# EAGLE design wd-adapter (EAGLE 6.5.0)
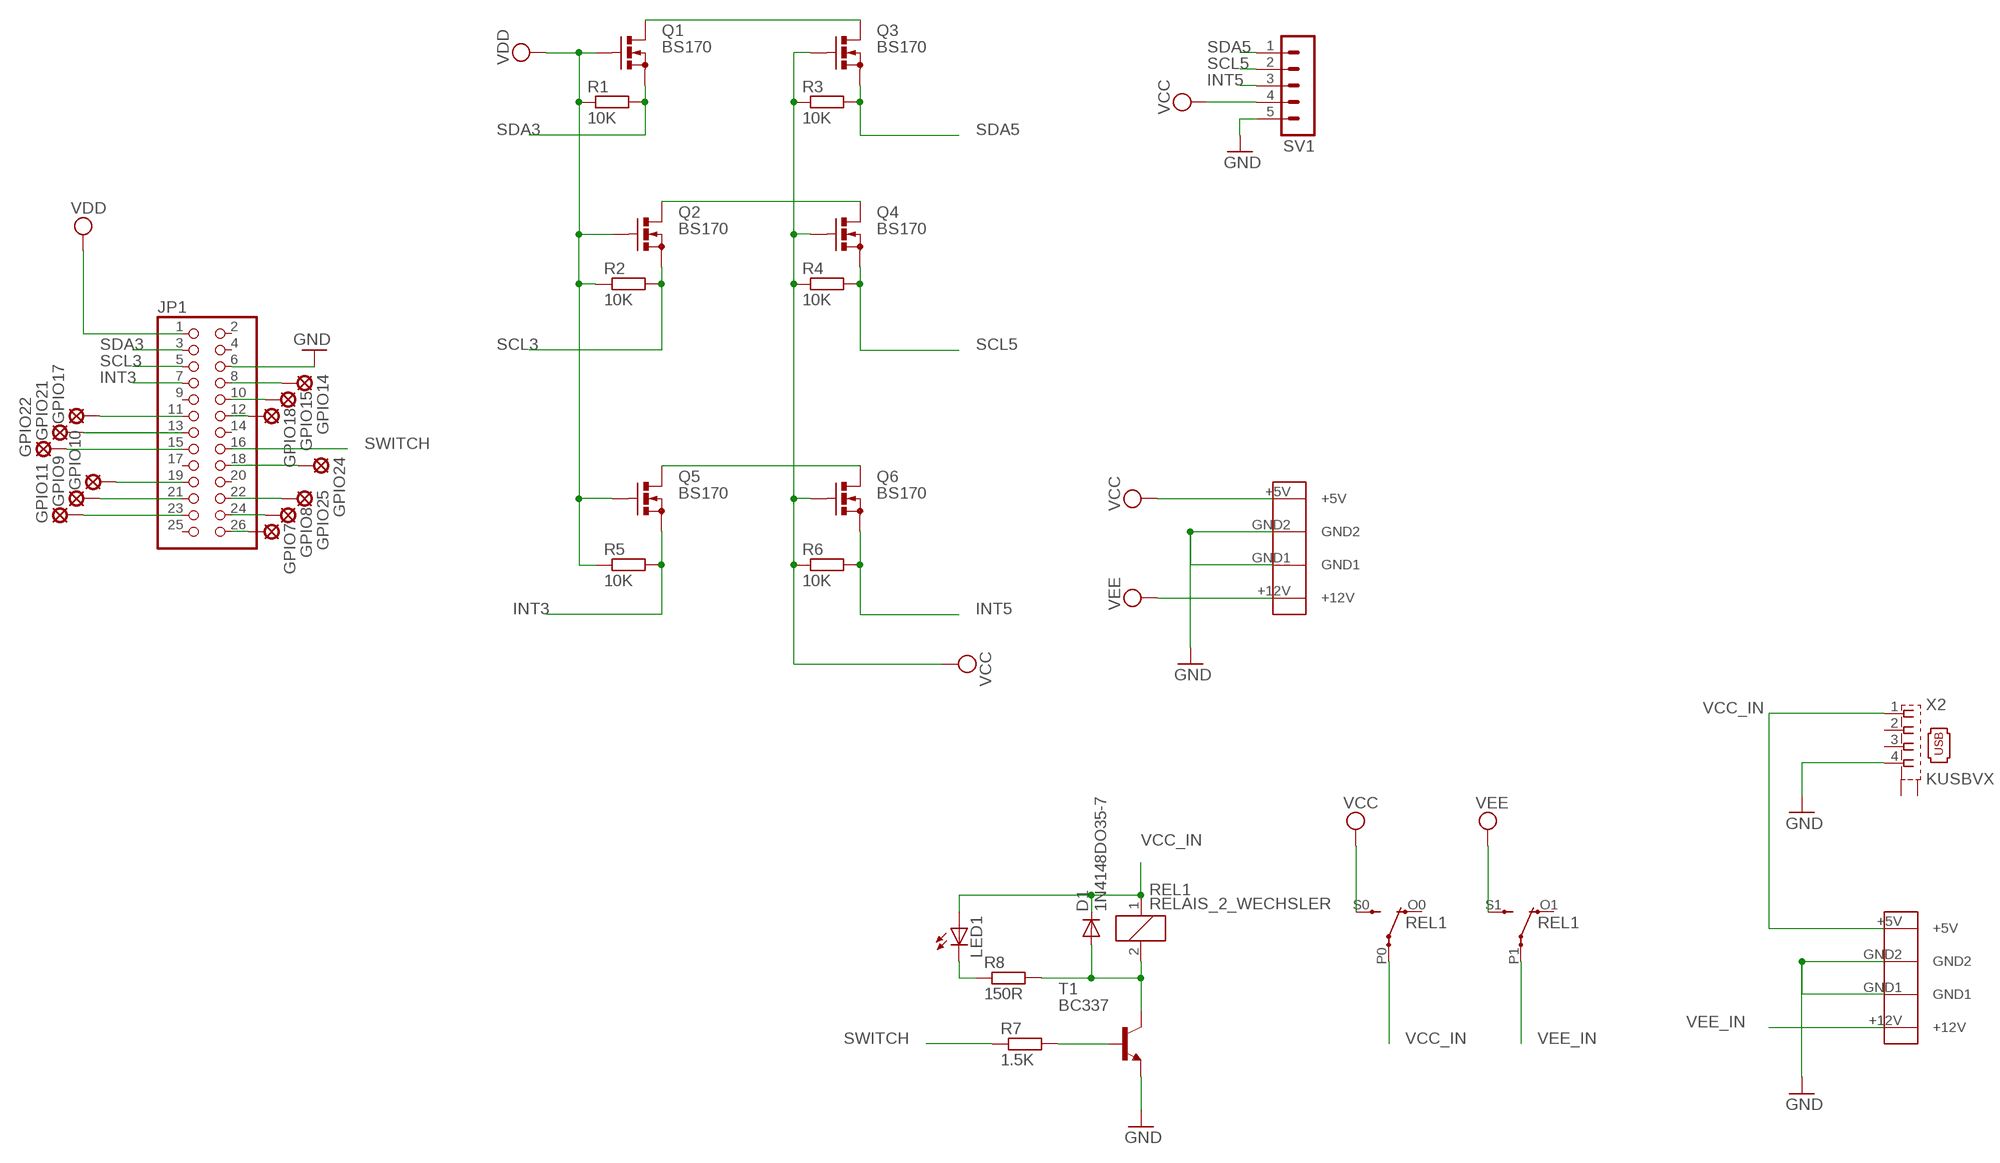
[diagram p0: schematic, sheet 1]

## Parts
D1  1N4148DO35-7  [DO35-7]
GPIO7  LSP10  [LSP10]
GPIO8  LSP10  [LSP10]
GPIO9  LSP10  [LSP10]
GPIO10  LSP10  [LSP10]
GPIO11  LSP10  [LSP10]
GPIO14  LSP10  [LSP10]
GPIO15  LSP10  [LSP10]
GPIO17  GPIO17  LSP10  [LSP10]
GPIO18  LSP10  [LSP10]
GPIO21  LSP10  [LSP10]
GPIO22  LSP10  [LSP10]
GPIO24  LSP10  [LSP10]
GPIO25  LSP10  [LSP10]
JP1  PINHD-2X13  [2X13]
LED1  LED3MM  [LED3MM]
Q1  BS170  [SOT54E]
Q2  BS170  [SOT54E]
Q3  BS170  [SOT54E]
Q4  BS170  [SOT54E]
Q5  BS170  [SOT54E]
Q6  BS170  [SOT54E]
R1  10K  R-EU_0207/2V  [0207/2V]
R2  10K  R-EU_0207/2V  [0207/2V]
R3  10K  R-EU_0207/2V  [0207/2V]
R4  10K  R-EU_0207/2V  [0207/2V]
R5  10K  R-EU_0207/2V  [0207/2V]
R6  10K  R-EU_0207/2V  [0207/2V]
R7  1.5K  R-EU_0207/7  [0207/7]
R8  150R  R-EU_0207/2V  [0207/2V]
REL1  RELAIS_2_WECHSLER  [RELAIS_DIL_M4]
SV1  MA05-1  [MA05-1]
T1  BC337  [TO92]
U$1  PSW_5  [PSW_5]
U$3  PSW_5  [PSW_5]
X2  KUSBVX  [KUSBVX]

## Nets
GND: JP1.6 SV1.5 T1.1(E) U$1.GND1 U$1.GND2 U$3.GND1 U$3.GND2 X2.4
INT3: JP1.7 Q5.S R5.2
INT5: Q6.S R6.2 SV1.3
N$1: GPIO17.MP JP1.11
N$2: GPIO21.MP JP1.13
N$3: GPIO22.MP JP1.15
N$4: GPIO10.MP JP1.19
N$5: GPIO9.MP JP1.21
N$6: GPIO11.MP JP1.23
N$7: GPIO14.MP JP1.8
N$8: GPIO15.MP JP1.10
N$9: GPIO18.MP JP1.12
N$10: LED1.K(C) R8.1
N$11: GPIO24.MP JP1.18
N$12: GPIO25.MP JP1.22
N$13: GPIO8.MP JP1.24
N$14: GPIO7.MP JP1.26
N$15: Q1.D Q3.D
N$16: Q2.D Q4.D
N$17: Q5.D Q6.D
N$18: D1.A R8.2 REL1.2 T1.3(C)
N$20: R7.2 T1.2(B)
SCL3: JP1.5 Q2.S R2.2
SCL5: Q4.S R4.2 SV1.2
SDA3: JP1.3 Q1.S R1.2
SDA5: Q3.S R3.2 SV1.1
SWITCH: JP1.16 R7.1
VCC: Q3.G Q4.G Q6.G R3.1 R4.1 R6.1 REL1.S0(W1:S) SV1.4 U$1.+5V
VCC_IN: D1.C LED1.A REL1.1 REL1.P0(W1:P) U$3.+5V X2.1
VDD: JP1.1 Q1.G Q2.G Q5.G R1.1 R2.1 R5.1
VEE: REL1.S1(W2:S) U$1.+12V
VEE_IN: REL1.P1(W2:P) U$3.+12V
Unconnected: JP1.2 JP1.4 JP1.9 JP1.14 JP1.17 JP1.20 JP1.25 REL1.O0(W1:O) REL1.O1(W2:O) X2.2 X2.3 X2.M1(S1) X2.M2(S2)

## Library data of the parts
D1 = diode:1N4148: DIODE high speed (Philips)
GPIO7-GPIO11 GPIO14 GPIO15 GPIO17 GPIO18 GPIO21 GPIO22 GPIO24 GPIO25 = solpad:LSP10: SOLDER PAD drill 1.0 mm, distributor Buerklin, 12H555
JP1 = pinhead:PINHD-2X13: PIN HEADER
LED1 = led:LED: LED OSRAM: - CHIPLED LG R971, LG N971, LY N971, LG Q971, LY Q971, LO R971, LY R971 LH N974, LH R974 LS Q976, LO Q976, LY Q976 LO Q996 - Hyper CHIPLED LW Q18S LB Q993, LB Q99A, LB R99A - SideLED LS A670, LO A670, LY A670, LG A670, LP A670 LB A673, LV A673, LT A673, LW A673 LH A674 LY A675 LS A676, LA A676, LO A676, LY A676, LW A676 LS A679, LY A679, LG A679 - Hyper Micro SIDELED® LS Y876, LA Y876, LO Y876, LY Y876 LT Y87S - SmartLED LW L88C, LW L88S LB L89C, LB L89S, LG L890 LS L89K, LO L89K, LY L89K LS L896, LA L896, LO L896, LY L896 - TOPLED LS T670, LO T670, LY T670, LG T670, LP T670 LSG T670, LSP T670, LSY T670, LOP T670, LYG T670 LG T671, LOG T671, LSG T671 LB T673, LV T673, LT T673, LW T673 LH T674 LS T676, LA T676, LO T676, LY T676, LB T676, LH T676, LSB T676, LW T676 LB T67C, LV T67C, LT T67C, LS T67K, LO T67K, LY T67K, LW E67C LS E67B, LA E67B, LO E67B, LY E67B, LB E67C, LV E67C, LT E67C LW T67C LS T679, LY T679, LG T679 LS T770, LO T770, LY T770, LG T770, LP T770 LB T773, LV T773, LT T773, LW T773 LH T774 LS E675, LA E675, LY E675, LS T675 LS T776, LA T776, LO T776, LY T776, LB T776 LHGB T686 LT T68C, LB T68C - Hyper Mini TOPLED® LB M676 - Mini TOPLED Santana® LG M470 LS M47K, LO M47K, LY M47K Source: http://www.osram.convergy.de LUXEON: - LUMILED® LXK2-PW12-R00, LXK2-PW12-S00, LXK2-PW14-U00, LXK2-PW14-V00 LXK2-PM12-R00, LXK2-PM12-S00, LXK2-PM14-U00 LXK2-PE12-Q00, LXK2-PE12-R00, LXK2-PE12-S00, LXK2-PE14-T00, LXK2-PE14-U00 LXK2-PB12-K00, LXK2-PB12-L00, LXK2-PB12-M00, LXK2-PB14-N00, LXK2-PB14-P00, LXK2-PB14-Q00 LXK2-PR12-L00, LXK2-PR12-M00, LXK2-PR14-Q00, LXK2-PR14-R00 LXK2-PD12-Q00, LXK2-PD12-R00, LXK2-PD12-S00 LXK2-PH12-R00, LXK2-PH12-S00 LXK2-PL12-P00, LXK2-PL12-Q00, LXK2-PL12-R00 Source: www.luxeon.com KINGBRIGHT: KA-3528ASYC Source: www.kingbright.com
Q1-Q6 = transistor-small-signal:BS170: N-CHANNEL MOS FET
R1-R8 = resistor:R-EU_: RESISTOR, European symbol
REL1 = n39:RELAIS_2_WECHSLER: 2-fach Wechsel-Relais Packages: M4 5V Spulenspannung (Reichelt M4 05H) Autor: Tux
SV1 = con-lstb:MA05-1: PIN HEADER; OC_FARNELL: unknown; OC_NEWARK: unknown
T1 = transistor:BC337: NPN TRANSISTOR
U$1 U$3 = n39:PSW_5: PSW 5 Stromversorgungsstecker f. 5 1/4 Zoll, Print, gew. http://www.reichelt.de/?ARTICLE=14915
X2 = con-kycon:KUSBVX: Vertical,Top Entry Universal Serial Bus Connector KUSBVX Series Source: KYCON Sibalco USB vertical socket KUSBV.pdf

## Board
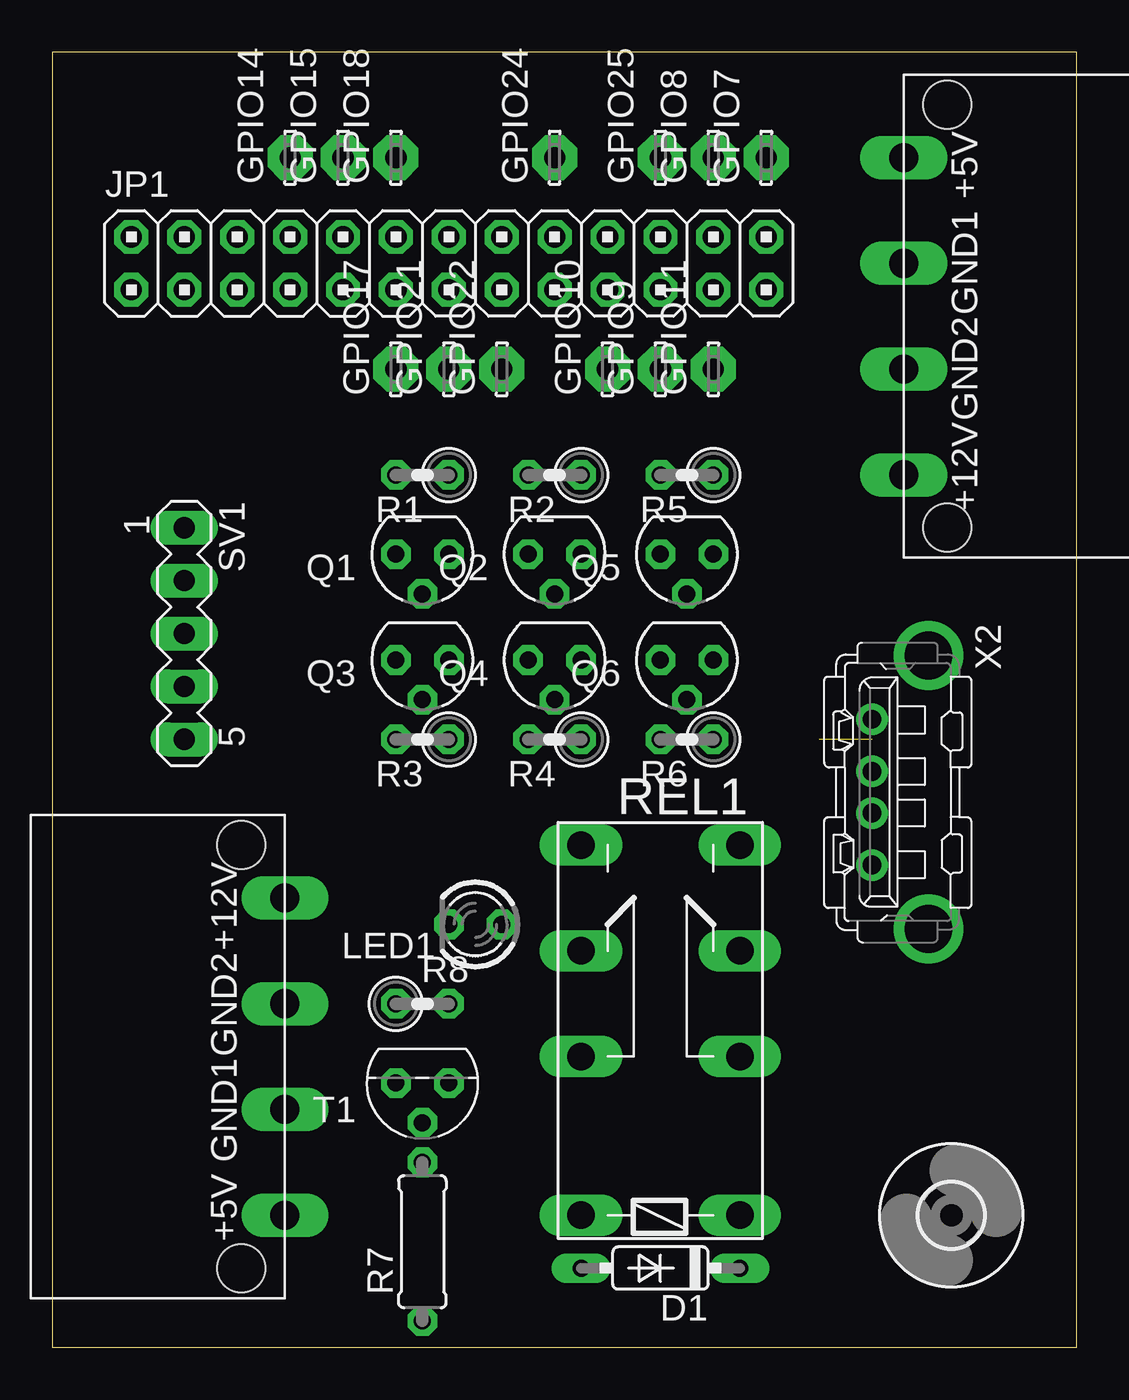
[diagram p1: board, top side]
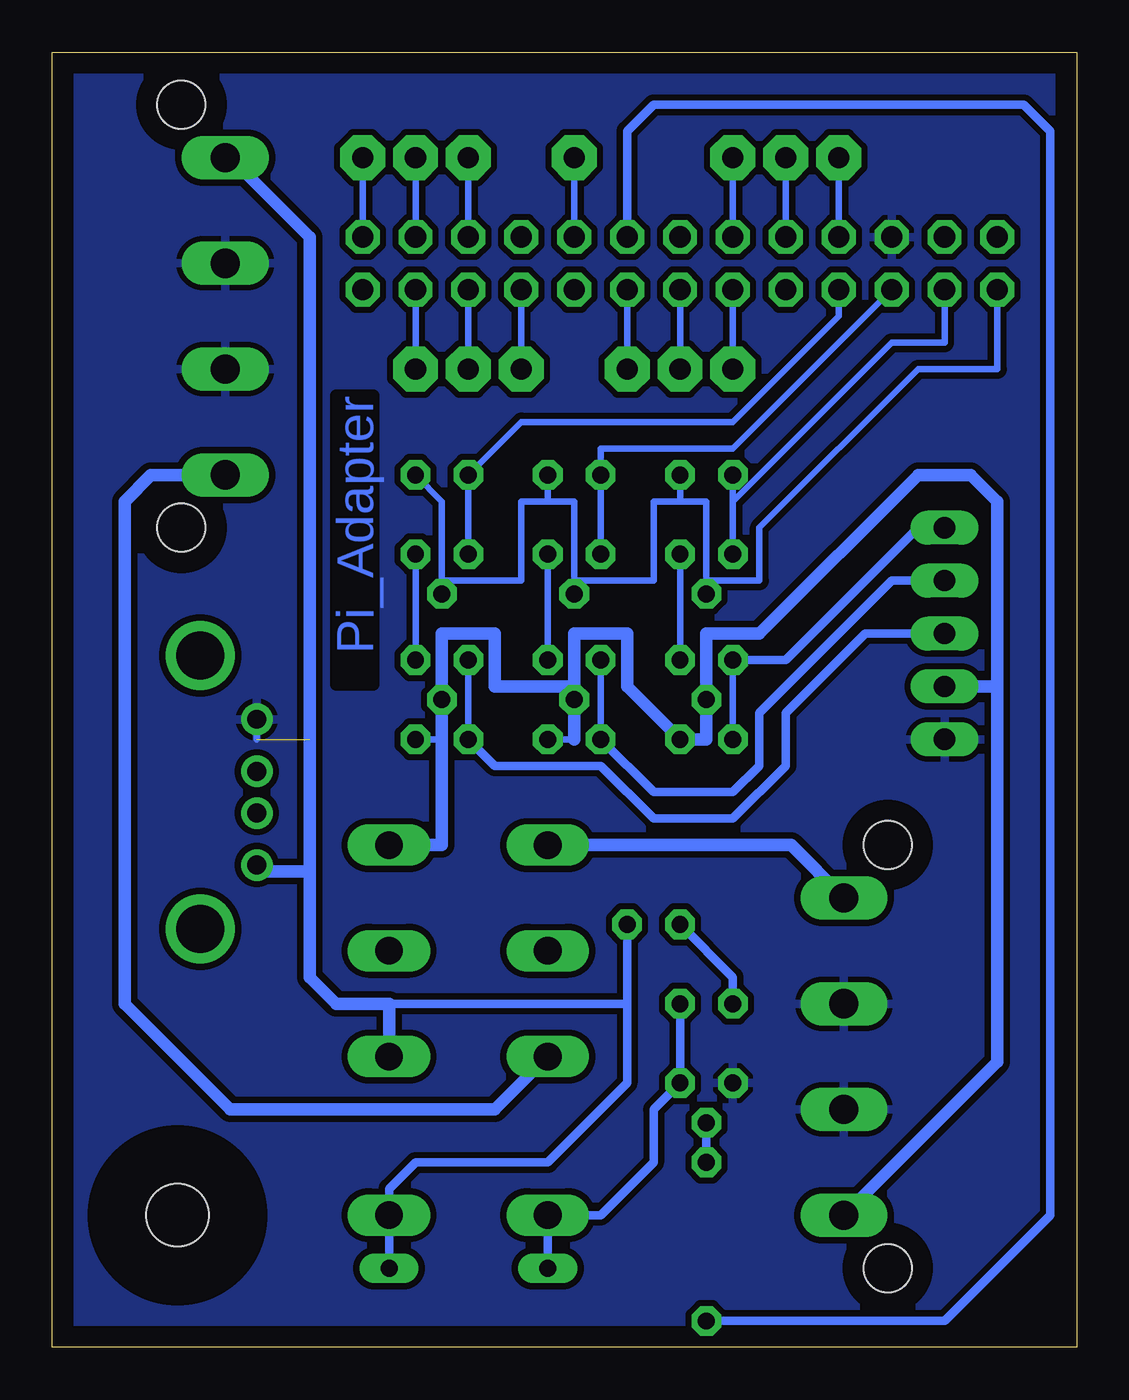
[diagram p2: board, bottom side, seen from below]

Size 49.2 x 62.22 mm. Coordinates in mm from the lower left corner, seen from the top.
Outline: 0,0 49.2,0 49.2,62.22 0,62.22 0,0
Copper layers (1*16): Top 0.035mm / dielectric 1.5mm / Bottom 0.035mm
Design rules "default *": minimum track width 10mil, minimum drill 24mil, track to track 12mil, track to pad 12mil, pad to pad 10mil, via to via 10mil, smd to smd 8mil, copper to edge 40mil, drill to drill 8mil, minimum pad ring 12mil, minimum via ring 8mil, stop-mask expansion 4mil, vias tented up to drill 0mil, thermal gap 10mil

### Footprints (pad centres in the part's own frame; a part is rotated, then mirrored left to right if it is on the bottom)
DO35-7 = drill 0.813 long: A 3.81,0; C -3.81,0
LSP10 = drill 1.016 pad 2.159 octagon: MP 0,0
2X13 = drill 1.016 octagon: 1 -15.24,-1.27; 2 -15.24,1.27; 3 -12.7,-1.27; 4 -12.7,1.27; 5 -10.16,-1.27; 6 -10.16,1.27; 7 -7.62,-1.27; 8 -7.62,1.27; 9 -5.08,-1.27; 10 -5.08,1.27; 11 -2.54,-1.27; 12 -2.54,1.27; 13 0,-1.27; 14 0,1.27; 15 2.54,-1.27; 16 2.54,1.27; 17 5.08,-1.27; 18 5.08,1.27; 19 7.62,-1.27; 20 7.62,1.27; 21 10.16,-1.27; 22 10.16,1.27; 23 12.7,-1.27; 24 12.7,1.27; 25 15.24,-1.27; 26 15.24,1.27
LED3MM = drill 0.813 octagon: A -1.27,0; K 1.27,0
SOT54E = drill 0.813 octagon: D -1.27,0; G 0,1.905; S 1.27,0
0207/2V = drill 0.813 octagon: 1 -1.27,0; 2 1.27,0
0207/7 = drill 0.813 octagon: 1 -3.81,0; 2 3.81,0
RELAIS_DIL_M4 = drill 1.321 long: 1 -7.62,-2.54; 2 -7.62,5.08; O0 5.08,-2.54; O1 5.08,5.08; P0 0,-2.54; P1 0,5.08; S0 10.16,-2.54; S1 10.16,5.08
MA05-1 = drill 1.016 long: 1 -5.08,0; 2 -2.54,0; 3 0,0; 4 2.54,0; 5 5.08,0
TO92 = drill 0.813 octagon: 1 1.27,0; 2 0,1.905; 3 -1.27,0
PSW_5 = drill 1.4 long: +5V -7.62,-6.1; +12V 7.62,-6.1; GND1 -2.54,-6.1; GND2 2.54,-6.1 | hole 2.3: -10.16,-4; 10.16,-4
3,0 = hole 3: 0,0
KUSBVX = drill 0.9 pad 1.3: 1 3.5,0; 2 1,0; 3 -1,0; 4 -3.5,0 | drill 2.3 pad 2.8: M1 -6.57,2.71; M2 6.57,2.71

### Placement (x,y rotation side)
D1  29.21,3.81 180 top
GPIO7  34.29,57.15 90 top
GPIO8  31.75,57.15 90 top
GPIO9  29.21,46.99 90 top
GPIO10  26.67,46.99 90 top
GPIO11  31.75,46.99 90 top
GPIO14  11.43,57.15 90 top
GPIO15  13.97,57.15 90 top
GPIO17  16.51,46.99 90 top
GPIO18  16.51,57.15 90 top
GPIO21  19.05,46.99 90 top
GPIO22  21.59,46.99 90 top
GPIO24  24.13,57.15 90 top
GPIO25  29.21,57.15 90 top
JP1  19.05,52.07 0 top
LED1  20.32,20.32 180 top
Q1  17.78,38.1 180 top
Q2  24.13,38.1 180 top
Q3  17.78,33.02 180 top
Q4  24.13,33.02 180 top
Q5  30.48,38.1 180 top
Q6  30.48,33.02 180 top
R1  17.78,41.91 180 top
R2  24.13,41.91 180 top
R3  17.78,29.21 180 top
R4  24.13,29.21 180 top
R5  30.48,41.91 180 top
R6  30.48,29.21 180 top
R7  17.78,5.08 90 top
R8  17.78,16.51 0 top
REL1  30.48,13.97 90 top
SV1  6.35,34.29 270 top
T1  17.78,12.7 180 top
U$1  5.08,13.97 90 top
U$2  [3,0]  43.18,6.35 0 top
U$3  46.99,49.53 270 top
X2  39.37,26.67 270 top

### Tracks (layer width: path | path; a pad name or v marks a point on that pad's centre or on a via)
GND  (1 unrouted)
  Bottom 0.305: 39.37,29.21 X2.4 | 36.83,29.21 36.83,41.91
  pour Bottom (isolate 0.254): 0,62.23 49.53,62.23 49.53,0 0,0
INT3
  Bottom 0.305: Q5.S R5.2 26.67,44.45 16.51,44.45 11.43,49.53 JP1.7
INT5
  Bottom 0.305: Q6.S R6.2
  Bottom 0.406: R6.2 27.94,27.94 22.86,27.94 20.32,25.4 16.51,25.4 13.97,27.94 13.97,30.48 10.16,34.29 SV1.3
N$1
  Bottom 0.305: GPIO17.MP JP1.11
N$2
  Bottom 0.305: GPIO21.MP JP1.13
N$3
  Bottom 0.305: GPIO22.MP JP1.15
N$4
  Bottom 0.305: GPIO10.MP JP1.19
N$5
  Bottom 0.305: GPIO9.MP JP1.21
N$6
  Bottom 0.305: GPIO11.MP JP1.23
N$7
  Bottom 0.305: GPIO14.MP JP1.8
N$8
  Bottom 0.305: GPIO15.MP JP1.10
N$9
  Bottom 0.305: GPIO18.MP JP1.12
N$10
  Bottom 0.406: R8.1 16.51,17.78 LED1.K
N$11
  Bottom 0.305: GPIO24.MP JP1.18
N$12
  Bottom 0.305: GPIO25.MP JP1.22
N$13
  Bottom 0.305: GPIO8.MP JP1.24
N$14
  Bottom 0.305: GPIO7.MP JP1.26
N$15
  Bottom 0.305: Q1.D Q3.D
N$16
  Bottom 0.305: Q2.D Q4.D
N$17
  Bottom 0.305: Q5.D Q6.D
N$18
  Bottom 0.406: R8.2 T1.3 20.32,11.43 20.32,8.89 22.86,6.35 REL1.2 D1.A
N$20
  Bottom 0.406: T1.2 R7.2
SCL3
  Bottom 0.305: Q2.S R2.2 22.86,43.18 16.51,43.18 JP1.5
SCL5
  Bottom 0.305: Q4.S R4.2
  Bottom 0.406: R4.2 20.32,26.67 16.51,26.67 15.24,27.94 15.24,30.48 8.89,36.83 SV1.2
SDA3
  Bottom 0.305: R1.2 16.51,40.64 | 16.51,40.64 Q1.S | 16.51,40.64 8.89,48.26 6.35,48.26 JP1.3
SDA5
  Bottom 0.305: Q3.S R3.2
  Bottom 0.406: SV1.1 7.62,39.37 13.97,33.02 Q3.S
SWITCH
  Bottom 0.406: JP1.16 21.59,58.42 20.32,59.69 2.54,59.69 1.27,58.42 1.27,6.35 6.35,1.27 R7.1
VCC
  Bottom 0.254: 24.13,29.21 Q4.G 24.13,31.75 | 17.78,29.21 Q3.G 17.78,31.75
  Bottom 0.305: R4.1 24.13,29.21 | 30.48,29.21 R6.1
  Bottom 0.61: 24.13,31.75 27.94,31.75 27.94,34.29 30.48,34.29 Q6.G 30.48,29.21 30.48,24.13 REL1.S0 | 24.13,29.21 24.13,34.29 21.59,34.29 21.59,31.75 R3.1 17.78,29.21 17.78,34.29 15.24,34.29 7.62,41.91 5.08,41.91 3.81,40.64 3.81,31.75 | U$1.+5V 3.81,13.72 3.81,31.75 | SV1.4 3.81,31.75
VCC_IN
  Bottom 0.406: U$3.+5V 40.64,57.15 | D1.C REL1.1 33.02,7.62 31.75,8.89 25.4,8.89 21.59,12.7 21.59,16.51 | 21.59,16.51 33.02,16.51 | LED1.A 21.59,16.51
  Bottom 0.61: 40.64,57.15 36.83,53.34 36.83,22.86 | 36.83,22.86 36.83,17.78 35.56,16.51 33.02,16.51 REL1.P0 | X2.1 39.06,22.86 36.83,22.86
VDD
  Bottom 0.305: 30.48,36.83 30.48,40.64 R5.1 | 25.4,40.64 24.13,40.64 24.13,36.83 | R2.1 25.4,40.64 | 17.78,36.83 17.78,40.64 19.05,40.64 | JP1.1 3.81,46.99 7.62,46.99 15.24,39.37 15.24,36.83 17.78,36.83 | 17.78,36.83 Q1.G | 24.13,36.83 20.32,36.83 20.32,40.64 19.05,40.64 | 24.13,36.83 Q2.G | 30.48,36.83 26.67,36.83 26.67,40.64 25.4,40.64 | 30.48,36.83 Q5.G | R1.1 19.05,40.64
VEE
  Bottom 0.61: U$1.+12V 13.72,24.13 REL1.S1
VEE_IN
  Bottom 0.61: REL1.P1 27.94,11.43 40.64,11.43 45.72,16.51 45.72,40.64 44.45,41.91 U$3.+12V

### Text on the board
Bottom: Pi_Adapter